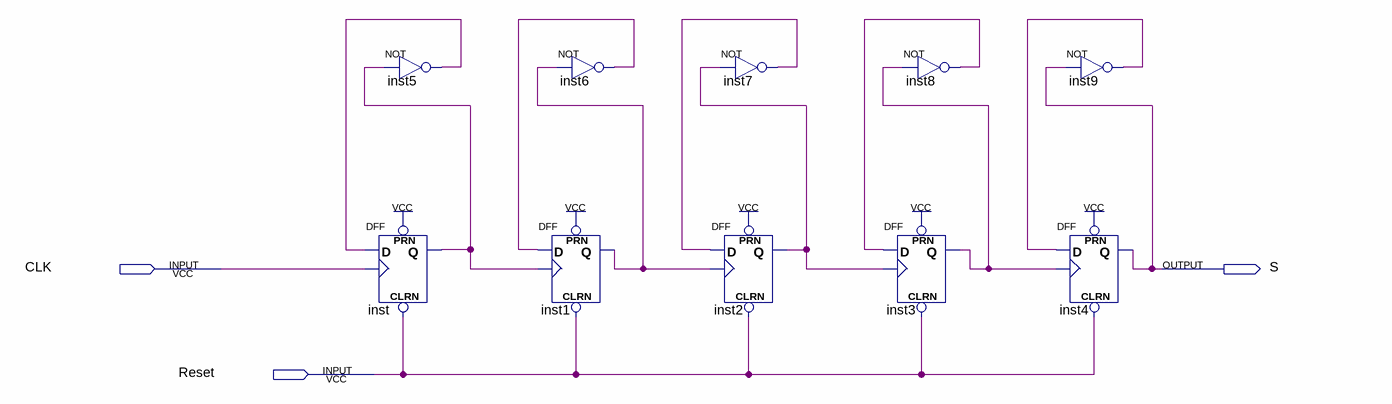
[diagram p0: schematic sheet]
// Quartus schematic freqDiv_x5.bdf as structural Verilog: 10 symbols, 3 pins
module freqDiv_x5 (
  input  CLK,
  input  Reset,
  output S
);

  wire inst1_q, inst2_q, inst3_q, inst5_out, inst6_out, inst7_out, inst8_out, inst9_out, inst_q;

  not inst5 (inst5_out, inst_q);
  DFF inst (.CLRN(Reset), .CLK(CLK), .D(inst5_out), .PRN(1'b1), .Q(inst_q));
  not inst6 (inst6_out, inst1_q);
  DFF inst1 (.CLRN(Reset), .CLK(inst_q), .D(inst6_out), .PRN(1'b1), .Q(inst1_q));
  not inst7 (inst7_out, inst2_q);
  DFF inst2 (.CLRN(Reset), .CLK(inst1_q), .D(inst7_out), .PRN(1'b1), .Q(inst2_q));
  DFF inst3 (.CLRN(Reset), .CLK(inst2_q), .D(inst8_out), .PRN(1'b1), .Q(inst3_q));
  not inst8 (inst8_out, inst3_q);
  not inst9 (inst9_out, S);
  DFF inst4 (.CLRN(Reset), .CLK(inst3_q), .D(inst9_out), .PRN(1'b1), .Q(S));
endmodule
